# EAGLE design Level-Shifter-6_v10 (EAGLE 7.7.0)
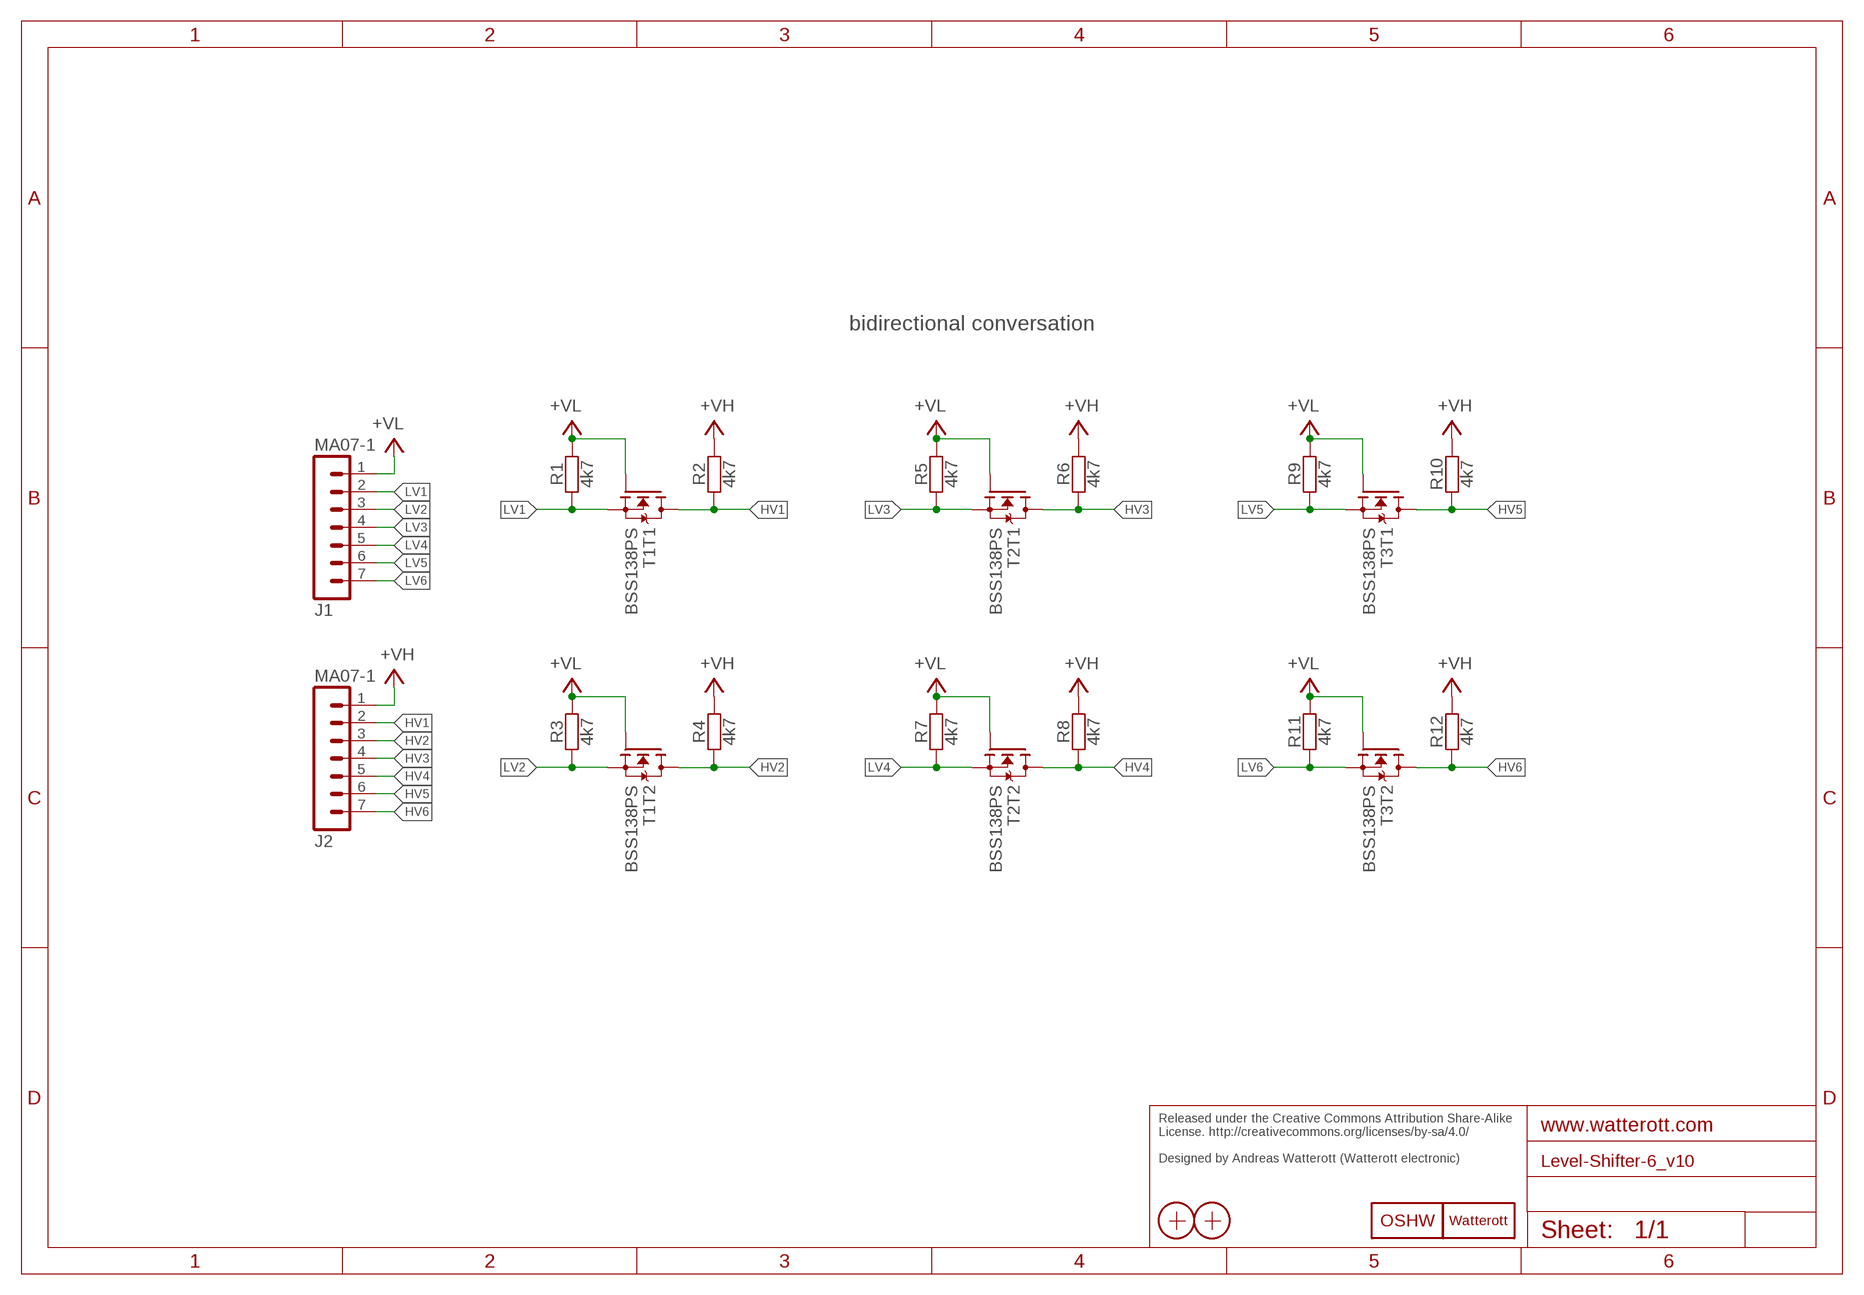
[diagram p0: schematic, sheet 1]

## Parts
J1  MA07-1  [MA07-1]
J2  MA07-1  [MA07-1]
LOGO1  OSHW_LOGOX0070  [OSHW_6X70]
LOGO2  LOGO-S_PLACE_S  [SPARK_TPLACE_S]
R1  4k7  RESISTOR-0402  [C0402]
R2  4k7  RESISTOR-0402  [C0402]
R3  4k7  RESISTOR-0402  [C0402]
R4  4k7  RESISTOR-0402  [C0402]
R5  4k7  RESISTOR-0402  [C0402]
R6  4k7  RESISTOR-0402  [C0402]
R7  4k7  RESISTOR-0402  [C0402]
R8  4k7  RESISTOR-0402  [C0402]
R9  4k7  RESISTOR-0402  [C0402]
R10  4k7  RESISTOR-0402  [C0402]
R11  4k7  RESISTOR-0402  [C0402]
R12  4k7  RESISTOR-0402  [C0402]
T1  BSS138PS  [SOT363]
T2  BSS138PS  [SOT363]
T3  BSS138PS  [SOT363]
X1  PASSER-07  [PASSER_07MM]
X2  PASSER-07  [PASSER_07MM]

## Nets
+VH: J2.1 R2.2 R4.2 R6.2 R8.2 R10.2 R12.2
+VL: J1.1 R1.2 R3.2 R5.2 R7.2 R9.2 R11.2 T1.2(T1:G) T1.5(T2:G) T2.2(T1:G) T2.5(T2:G) T3.2(T1:G) T3.5(T2:G)
HV1: J2.2 R2.1 T1.6(T1:D)
HV2: J2.3 R4.1 T1.3(T2:D)
HV3: J2.4 R6.1 T2.6(T1:D)
HV4: J2.5 R8.1 T2.3(T2:D)
HV5: J2.6 R10.1 T3.6(T1:D)
HV6: J2.7 R12.1 T3.3(T2:D)
LV1: J1.2 R1.1 T1.1(T1:S)
LV2: J1.3 R3.1 T1.4(T2:S)
LV3: J1.4 R5.1 T2.1(T1:S)
LV4: J1.5 R7.1 T2.4(T2:S)
LV5: J1.6 R9.1 T3.1(T1:S)
LV6: J1.7 R11.1 T3.4(T2:S)

## Notes on the sheet
- bidirectional conversation
- Released under the Creative Commons Attribution Share-Alike 
  License. http://creativecommons.org/licenses/by-sa/4.0/
  
  Designed by Andreas Watterott (Watterott electronic)

## Library data of the parts
J1 J2 = we-con:MA07-1: Pin Header
LOGO1 = we-symbol:OSHW_LOGO: Open-Source-Hardware Logo
LOGO2 = we-symbol:LOGO: Watterott electronic Logo
R1-R12 = we-rcl:RESISTOR: Resistors all kinds in 0402 and 0603
T1-T3 = we-transistor:BSS138PS: Dual N-Channel MOSFET BSS138 (Vgs>=+/-20V, Vds>=40V, Id>=0.2A + Rds<=3Ohm @ Vgs=4.5V)
X1 X2 = we-symbol:PASSER: Fiducial Markers

## Board
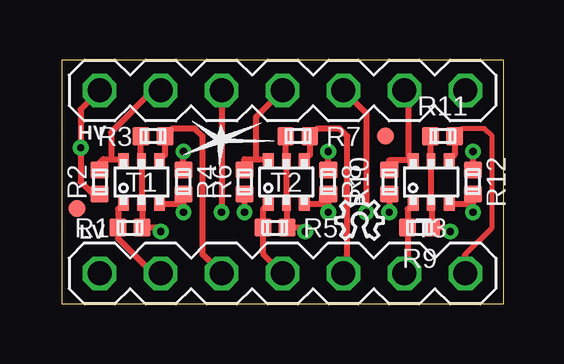
[diagram p1: board, top side]
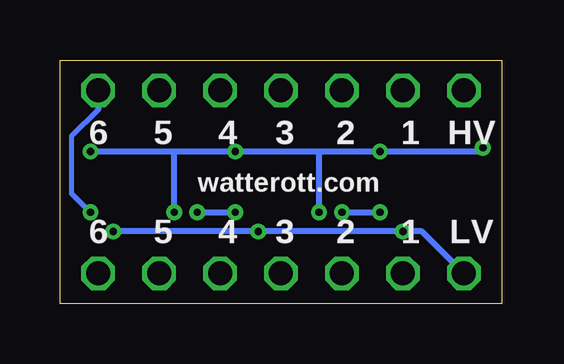
[diagram p2: board, bottom side, seen from below]

Size 18.41 x 10.16 mm. Coordinates in mm from the lower left corner, seen from the top.
Outline: 0,0 18.41,0 18.41,10.16 0,10.16 0,0
Copper layers (1*16): Top 0.035mm / dielectric 1.5mm / Bottom 0.035mm
Design rules "we-dru-2-layer *": minimum track width 0.15mm, minimum drill 0.3mm, track to track 0.15mm, track to pad 0.15mm, pad to pad 0.15mm, via to via 0.15mm, smd to smd 0.1mm, copper to edge 0.35mm, drill to drill 0.2mm, minimum pad ring 0.18mm, minimum via ring 0.18mm, stop-mask expansion 0.1mm, vias tented up to drill 0.5mm, thermal gap 0.25mm

### Footprints (pad centres in the part's own frame; a part is rotated, then mirrored left to right if it is on the bottom)
MA07-1 = drill 1 octagon: 1 0,7.62; 2 0,5.08; 3 0,2.54; 4 0,0; 5 0,-2.54; 6 0,-5.08; 7 0,-7.62
C0402 = smd 0.75 x 0.7: 1 0,0.5; 2 0,-0.5
SOT363 = smd 0.6 x 0.5: 1 -0.9,0.75; 3 -0.9,-0.75; 4 0.9,-0.75; 6 0.9,0.75 | smd 0.6 x 0.4: 2 -0.9,0; 5 0.9,0
PASSER_07MM = smd 0.7 x 0.7: X 0,0

### Placement (x,y rotation side)
J1  9.21,1.27 90 top
J2  9.21,8.89 90 top
LOGO1  11.43,2.7 0 top
LOGO2  6.67,6.83 0 top
R1  2.86,3.17 90 top
R2  1.59,5.08 0 top
R3  3.81,6.99 270 top
R4  5.08,5.08 180 top
R5  8.89,3.17 90 top
R6  7.62,5.08 0 top
R7  9.84,6.99 270 top
R8  11.11,5.08 180 top
R9  14.92,3.17 90 top
R10  13.65,5.08 0 top
R11  15.88,6.99 270 top
R12  17.14,5.08 180 top
T1  3.33,5.08 90 top
T2  9.37,5.08 90 top
T3  15.4,5.08 90 top
X1  0.64,3.97 0 top
X2  13.49,6.99 0 top

### Tracks (layer width: path | path; a pad name or v marks a point on that pad's centre or on a via)
+VH  (via drill 0.3)
  Top 0.254: J2.1 0.79,8.1 v0.79,6.51 0.79,5.08 1.27,4.6 1.56,4.6 R2.2 | R4.2 v5.08,6.35 | R8.2 v11.11,6.35 | R12.2 v17.14,6.35 | R6.2 v7.62,3.81 | R10.2 v13.65,3.81
  Bottom 0.254: v17.14,6.35 13.65,6.35 | 13.65,6.35 v11.11,6.35 7.62,6.35 | 7.62,6.35 v5.08,6.35 0.95,6.35 v0.79,6.51 | v7.62,3.81 7.62,6.35 | v13.65,3.81 13.65,6.35
+VL  (via drill 0.3)
  Top 0.254: R3.2 3.31,5.98 T1.5 T1.2 3.36,4.18 R1.2 3.97,3.17 v4.13,3.02 | R7.2 9.34,5.98 T2.5 T2.2 9.39,4.18 R5.2 10,3.17 v10.16,3.02 | R11.2 15.38,5.98 T3.5 T3.2 15.42,4.18 R9.2 16.03,3.17 v16.19,3.02
  Bottom 0.254: J1.1 3.33,3.02 v4.13,3.02 v10.16,3.02 v16.19,3.02
HV1
  Top 0.254: R2.1 1.59,5.87 1.75,6.03 2.06,6.03 | 2.06,6.03 2.53,6.03 T1.6 | J2.2 3.81,8.89 2.06,7.14 2.06,6.03
HV2  (via drill 0.3)
  Top 0.254: J2.3 v6.67,3.81 | T1.3 5.08,4.18 | 5.08,4.18 R4.1 | v5.08,3.81 5.08,4.18
  Bottom 0.254: v6.67,3.81 v5.08,3.81
HV3
  Top 0.254: R6.1 7.62,6.03 8.1,6.03 | 8.1,6.03 8.56,6.03 T2.6 | J2.4 8.1,7.78 8.1,6.03
HV4  (via drill 0.3)
  Top 0.254: T2.3 11.11,4.18 | 11.11,4.18 R8.1 | J2.5 12.7,7.94 v12.7,3.81 | v11.11,3.81 11.11,4.18
  Bottom 0.254: v12.7,3.81 v11.11,3.81
HV5
  Top 0.254: T3.6 14.45,5.98 | 14.45,5.98 13.65,5.98 R10.1 | J2.6 14.45,8.73 14.45,5.98
HV6  (via drill 0.3)
  Top 0.254: T3.3 17.14,4.18 | 17.14,4.18 R12.1 | v17.14,3.81 17.14,4.18
  Bottom 0.203: v17.14,3.81 17.94,4.6 17.94,6.99 16.83,8.1
  Bottom 0.254: J2.7 16.83,8.1
LV1
  Top 0.254: T1.1 2.36,3.95 R1.1 2.36,2.72 3.81,1.27 J1.2
LV2
  Top 0.254: T1.4 4.31,6.21 R3.1 4.63,7.3 5.56,7.3 5.87,6.99 5.87,2.06 J1.3
LV3
  Top 0.254: T2.1 8.39,3.95 R5.1 8.39,2.09 J1.4
LV4
  Top 0.254: T2.4 10.34,6.21 R7.1 10.66,7.3 11.59,7.3 11.91,6.99 11.91,1.43 J1.5
LV5
  Top 0.254: T3.1 14.42,3.95 R9.1 14.42,1.41 J1.6
LV6
  Top 0.203: R11.1 16.69,7.3 17.62,7.3 17.94,6.99 17.94,3.17 16.83,2.06
  Top 0.254: R11.1 16.38,6.21 T3.4 | J1.7 16.83,2.06

### Text on the board
tPlace: HV | LV
bPlace: HV | 1 | 2 | 3 | 4 | 5 | 6 | watterott.com | LV | 1 | 2 | 3 | 4 | 5 | 6
Reference: Silkscreen: 21 tPlace + 22 bPlace